# Altium schematic sheet 11.SchDoc
size 420 x 297 mm
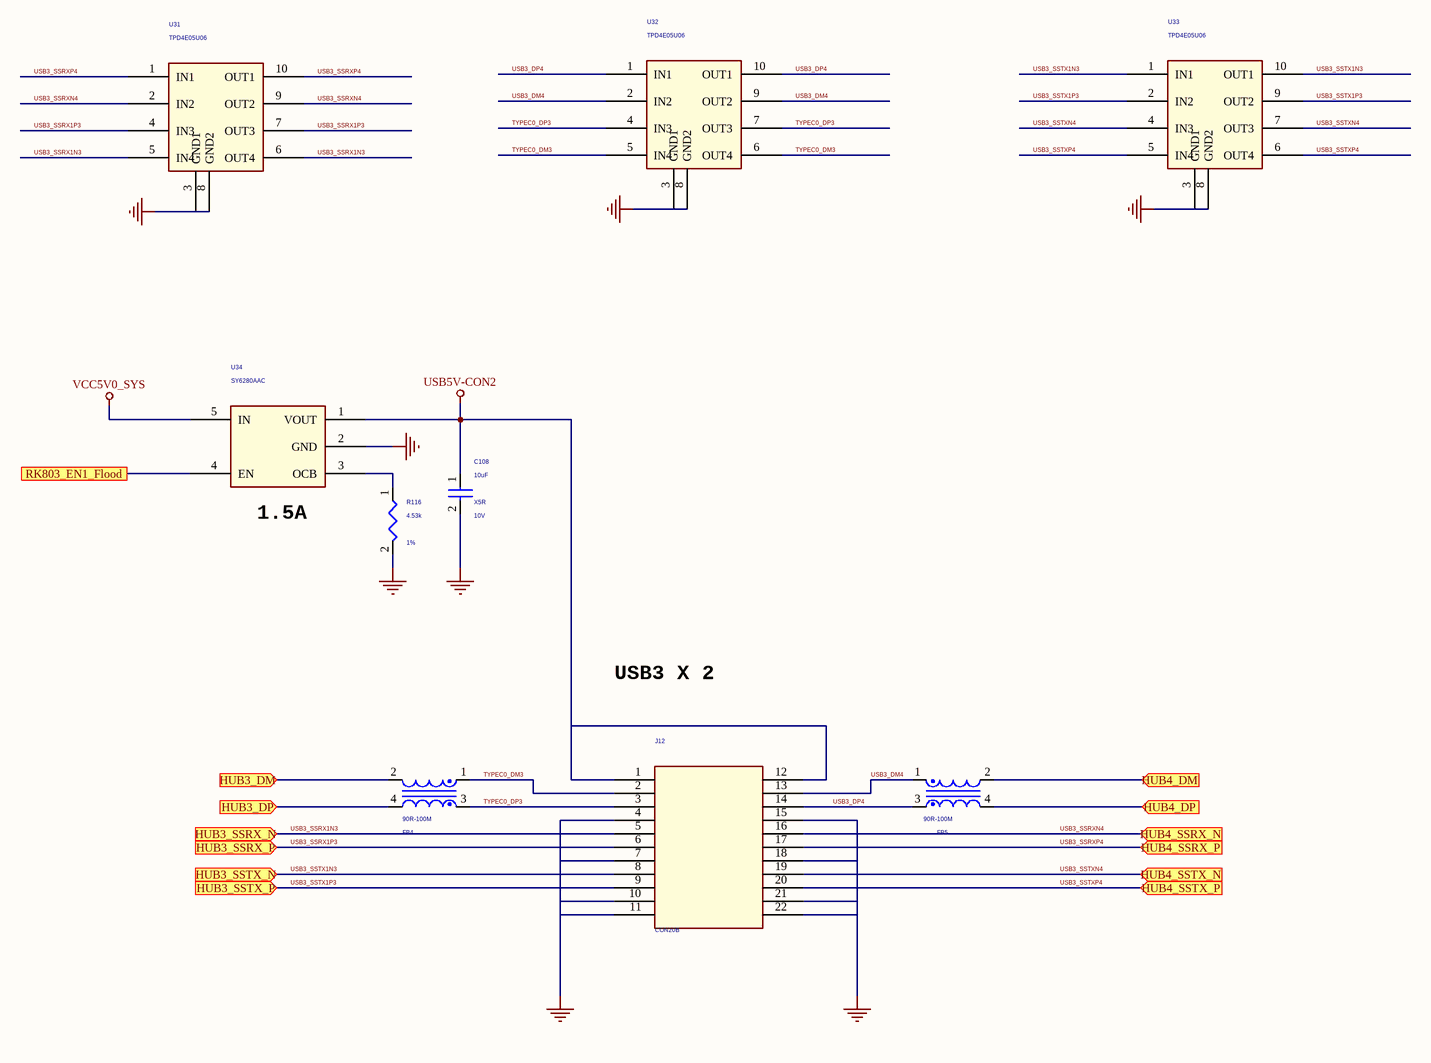
[diagram p0: 11.SchDoc]

## Parts
C108  10uF  Voltage: 10V  Dielectric: X5R  [C0603]
FB4  90R-100M  [L0402D]
FB5  90R-100M  [L0402D]
J12  CON20B  [USB30_DUAL]
R116  4.53k  Tolerance: 1%  [R0402]
U31  TPD4E05U06  [SON10_2R50X1R00X0R50]
U32  TPD4E05U06  [SON10_2R50X1R00X0R50]
U33  TPD4E05U06  [SON10_2R50X1R00X0R50]
U34  SY6280AAC  [SOT_23_5]

## Ports
HUB3_DM (in), HUB3_DP (in), HUB3_SSRX_N (in), HUB3_SSRX_P (in), HUB3_SSTX_N (in), HUB3_SSTX_P (in), HUB4_DM (in), HUB4_DP (in), HUB4_SSRX_N (in), HUB4_SSRX_P (in), HUB4_SSTX_N (in), HUB4_SSTX_P (in), RK803_EN1_Flood

## Nets
GND: C108.2 J12.4 J12.7 J12.10 J12.11 J12.15 J12.18 J12.21 J12.22 R116.2 U31.3(GND1) U31.8(GND2) U32.3(GND1) U32.8(GND2) U33.3(GND1) U33.8(GND2) U34.2(GND)
USB5V-CON2: C108.1 J12.1 J12.12 U34.1(VOUT)
VCC5V0_SYS: U34.5(IN)
HUB3_DM: FB4.2 ; port HUB3_DM
HUB3_DP: FB4.4 ; port HUB3_DP
HUB4_DM: FB5.2 ; port HUB4_DM
HUB4_DP: FB5.4 ; port HUB4_DP
RK803_EN1_Flood: U34.4(EN) ; port RK803_EN1_Flood
TYPEC0_DM3: FB4.1 J12.2 U32.5(IN4) U32.6(OUT4)
TYPEC0_DP3: FB4.3 J12.3 U32.4(IN3) U32.7(OUT3)
USB3_DM4: FB5.1 J12.13 U32.2(IN2) U32.9(OUT2)
USB3_DP4: FB5.3 J12.14 U32.1(IN1) U32.10(OUT1)
USB3_SSRX1N3: J12.5 U31.5(IN4) U31.6(OUT4) ; port HUB3_SSRX_N
USB3_SSRX1P3: J12.6 U31.4(IN3) U31.7(OUT3) ; port HUB3_SSRX_P
USB3_SSRXN4: J12.16 U31.2(IN2) U31.9(OUT2) ; port HUB4_SSRX_N
USB3_SSRXP4: J12.17 U31.1(IN1) U31.10(OUT1) ; port HUB4_SSRX_P
USB3_SSTX1N3: J12.8 U33.1(IN1) U33.10(OUT1) ; port HUB3_SSTX_N
USB3_SSTX1P3: J12.9 U33.2(IN2) U33.9(OUT2) ; port HUB3_SSTX_P
USB3_SSTXN4: J12.19 U33.4(IN3) U33.7(OUT3) ; port HUB4_SSTX_N
USB3_SSTXP4: J12.20 U33.5(IN4) U33.6(OUT4) ; port HUB4_SSTX_P
NetR116_1: R116.1 U34.3(OCB)

## Notes on the sheet
- (near U34) 1.5A
- USB3 X 2

## Library data of the parts
C108 = CAP NP: cap,10.00uF,+/-10%,10V,X5R,C0805; Manufacturer: TDK; RK PN: C2012X5R1A106K125AB; Priority: A; Tolerance: 10%; Part Type: C0805; Manufacturer PN: C2012X5R1A106K125AB; Created by: JJJ
FB4 = INDUCTOR COM: Multi-layer common mode filter array For high-speed differential signal lines.Differential mode cut-off frequency:MCZ1210AH series : 2.5GHz typ.MCZ1210CH series : 3.5GHz typ.MCZ1210DH series : 4 to 6GHz typ.; Manufacturer: EMC; RK PN: MCZ1210AH900L2T; Priority: A; DC Resistor: 1.75ohm; Irms: 200mA; Resonace frequency: 90R@100M; Part Type: BEAD; Manufacturer PN: MCZ1210AH900L2T; Created by: JJJ
FB5 = INDUCTOR COM: Multi-layer common mode filter array For high-speed differential signal lines.Differential mode cut-off frequency:MCZ1210AH series : 2.5GHz typ.MCZ1210CH series : 3.5GHz typ.MCZ1210DH series : 4 to 6GHz typ.; Manufacturer PN: MCZ1210AH900L2T; Manufacturer: EMC; Resonace frequency: 90R@100M; Irms: 200mA; DC Resistor: 1.75ohm; Priority: A; Created by: JJJ; Part Type: BEAD; RK PN: MCZ1210AH900L2T
J12 = CON20B_1
R116 = RESISTOR: 通用厚膜电阻,9K1,+/-1%,R0402,1/16W.; Manufacturer PN: RC0402FR-079K1L; Manufacturer: YAGEO; Wattage: 1/16W; Priority: A; Created by: YTL; Part Type: 通用厚膜电阻; RK PN: RC0402FR-079K1L
U31-U33 = ESD_TPD4E05U06: unidirectional ESD protection devices with ultra low capacitance; Manufacturer: TI（德州仪器）; Priority: A; Created by: JJJ; Manufacturer PN: TPD4E05U06; Part Type: ESD_TVS; RK PN: TPD4E05U06
U34 = SWITCH_SY6280: Low Loss Power Distribution Switch; Manufacturer: Silergy（矽力杰）; Priority: A; Created by: JJJ; Manufacturer PN: SY6280AAC; Part Type: Switch; RK PN: SY6280AAC